# EAGLE design tubos (EAGLE 7.1.0)
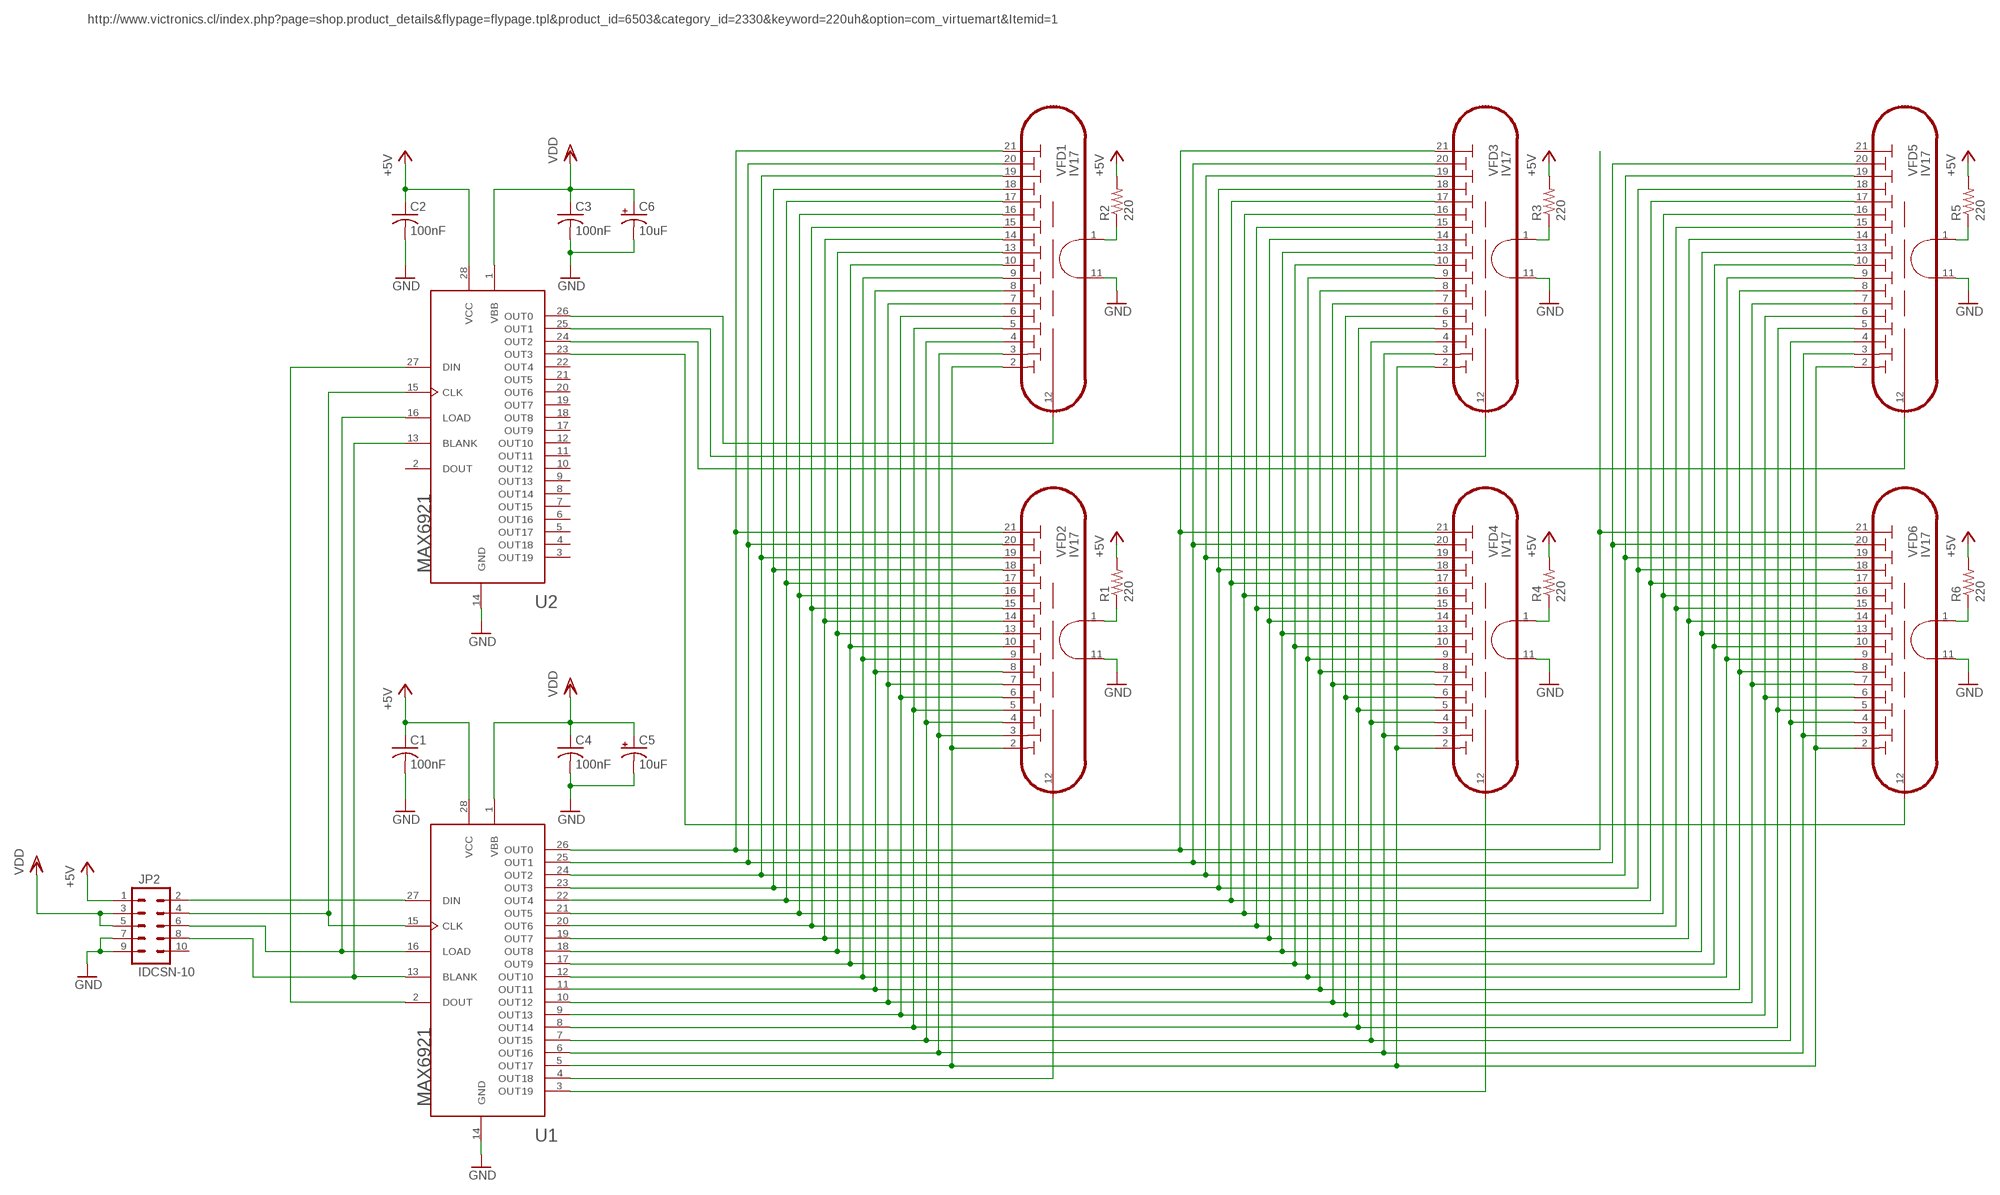
[diagram p0: schematic, sheet 1]

## Parts
C1  100nF  C-USC1206  [C1206]
C2  100nF  C-USC1206  [C1206]
C3  100nF  C-USC1210  [C1210]
C4  100nF  C-USC1210  [C1210]
C5  NACEW100M100V6.3X8TR  [NACEW100M100V6.3X8TR]
C6  NACEW100M100V6.3X8TR  [NACEW100M100V6.3X8TR]
JP2  IDCSN-10  [IDCSN-10]
R1  220  RESISTORPTH-1/4W  [AXIAL-0.4]
R2  220  RESISTORPTH-1/4W  [AXIAL-0.4]
R3  220  RESISTORPTH-1/4W  [AXIAL-0.4]
R4  220  RESISTORPTH-1/4W  [AXIAL-0.4]
R5  220  RESISTORPTH-1/4W  [AXIAL-0.4]
R6  220  RESISTORPTH-1/4W  [AXIAL-0.4]
U1  MAX6921AWI  [SO28W]
U2  MAX6921AWI  [SO28W]
VFD1  IV17  [CIRCULAR]
VFD2  IV17  [CIRCULAR]
VFD3  IV17  [CIRCULAR]
VFD4  IV17  [CIRCULAR]
VFD5  IV17  [CIRCULAR]
VFD6  IV17  [CIRCULAR]

## Nets
+5V [VCC]: C1.1 C2.1 JP2.1 R1.P$2 R2.P$2 R3.P$2 R4.P$2 R5.P$2 R6.P$2 U1.28(VCC) U2.28(VCC)
GND [GND]: C1.2 C2.2 C3.2 C4.2 C5.NEG(-) C6.NEG(-) JP2.7 JP2.9 U1.14(GND) U2.14(GND) VFD1.11 VFD2.11 VFD3.11 VFD4.11 VFD5.11 VFD6.11
N$1: U1.5(OUT17) VFD1.2 VFD2.2 VFD3.2 VFD4.2 VFD5.2 VFD6.2
N$2: R2.P$1 VFD1.1
N$3: U1.7(OUT15) VFD1.4 VFD2.4 VFD3.4 VFD4.4 VFD5.4 VFD6.4
N$4: R1.P$1 VFD2.1
N$5: U1.9(OUT13) VFD1.6 VFD2.6 VFD3.6 VFD4.6 VFD5.6 VFD6.6
N$6: R3.P$1 VFD3.1
N$7: U1.11(OUT11) VFD1.8 VFD2.8 VFD3.8 VFD4.8 VFD5.8 VFD6.8
N$8: U1.12(OUT10) VFD1.9 VFD2.9 VFD3.9 VFD4.9 VFD5.9 VFD6.9
N$9: R6.P$1 VFD6.1
N$10: U1.18(OUT8) VFD1.13 VFD2.13 VFD3.13 VFD4.13 VFD5.13 VFD6.13
N$11: R5.P$1 VFD5.1
N$12: U1.20(OUT6) VFD1.15 VFD2.15 VFD3.15 VFD4.15 VFD5.15 VFD6.15
N$13: U1.21(OUT5) VFD1.16 VFD2.16 VFD3.16 VFD4.16 VFD5.16 VFD6.16
N$14: U1.22(OUT4) VFD1.17 VFD2.17 VFD3.17 VFD4.17 VFD5.17 VFD6.17
N$15: R4.P$1 VFD4.1
N$16: U1.24(OUT2) VFD1.19 VFD2.19 VFD3.19 VFD4.19 VFD5.19 VFD6.19
N$17: U1.25(OUT1) VFD1.20 VFD2.20 VFD3.20 VFD4.20 VFD5.20 VFD6.20
N$18: U1.4(OUT18) VFD2.12
N$19: U1.3(OUT19) VFD4.12
N$20: U1.6(OUT16) VFD1.3 VFD2.3 VFD3.3 VFD4.3 VFD5.3 VFD6.3
N$21: U2.26(OUT0) VFD1.12
N$22: U1.8(OUT14) VFD1.5 VFD2.5 VFD3.5 VFD4.5 VFD5.5 VFD6.5
N$23: U2.25(OUT1) VFD3.12
N$24: U1.10(OUT12) VFD1.7 VFD2.7 VFD3.7 VFD4.7 VFD5.7 VFD6.7
N$25: U2.24(OUT2) VFD5.12
N$26: U2.23(OUT3) VFD6.12
N$27: U1.17(OUT9) VFD1.10 VFD2.10 VFD3.10 VFD4.10 VFD5.10 VFD6.10
N$28: U1.2(DOUT) U2.27(DIN)
N$29: U1.19(OUT7) VFD1.14 VFD2.14 VFD3.14 VFD4.14 VFD5.14 VFD6.14
N$30: JP2.4 U1.15(CLK) U2.15(CLK)
N$31: JP2.6 U1.16(LOAD) U2.16(LOAD)
N$32: JP2.8 U1.13(BLANK) U2.13(BLANK)
N$33: U1.23(OUT3) VFD1.18 VFD2.18 VFD3.18 VFD4.18 VFD5.18 VFD6.18
N$34: JP2.2 U1.27(DIN)
N$54: U1.26(OUT0) VFD1.21 VFD2.21 VFD3.21 VFD4.21 VFD6.21
VDD [VBB]: C3.1 C4.1 C5.POS(+) C6.POS(+) JP2.3 JP2.5 U1.1(VBB) U2.1(VBB)
Unconnected: JP2.10 U2.2(DOUT) U2.3(OUT19) U2.4(OUT18) U2.5(OUT17) U2.6(OUT16) U2.7(OUT15) U2.8(OUT14) U2.9(OUT13) U2.10(OUT12) U2.11(OUT11) U2.12(OUT10) U2.17(OUT9) U2.18(OUT8) U2.19(OUT7) U2.20(OUT6) U2.21(OUT5) U2.22(OUT4) VFD5.21

## Notes on the sheet
- http://www.victronics.cl/index.php?page=shop.product_details&flypage=flypage.tpl&product_id=6503&category_id=2330&keyword=220uh&option=com_virtuemart&Itemid=1

## Library data of the parts
C1-C4 = rcl:C-US: CAPACITOR, American symbol
C5 C6 = iv17:NACEW100M100V6.3X8TR: NACEW100M100V6.3X8TR 10uF 100v Surface Mount Aluminum Electrolytic Capacitor NACEW Series
JP2 = iv17:IDCSN-10: Conector idc 10p 90grad No parte: IDCSN-10 Fabricante: METALTEX
R1-R6 = SparkFun-Passives:RESISTOR: Resistor Basic schematic elements and footprints for 0603, 1206, and PTH resistors.
U1 U2 = iv17:MAX6921AWI: MAX6921AWI VFD Tube Drivers 20-Output, 76V, Serial-Interfaced
VFD1-VFD6 = iv17:IV17: IV-17 VFD 18seg display

## Net classes
1 GND: width 0.61 mm, clearance 0.203 mm
2 VCC: width 0.406 mm
3 VBB: width 0.406 mm, clearance 0.203 mm

## Board
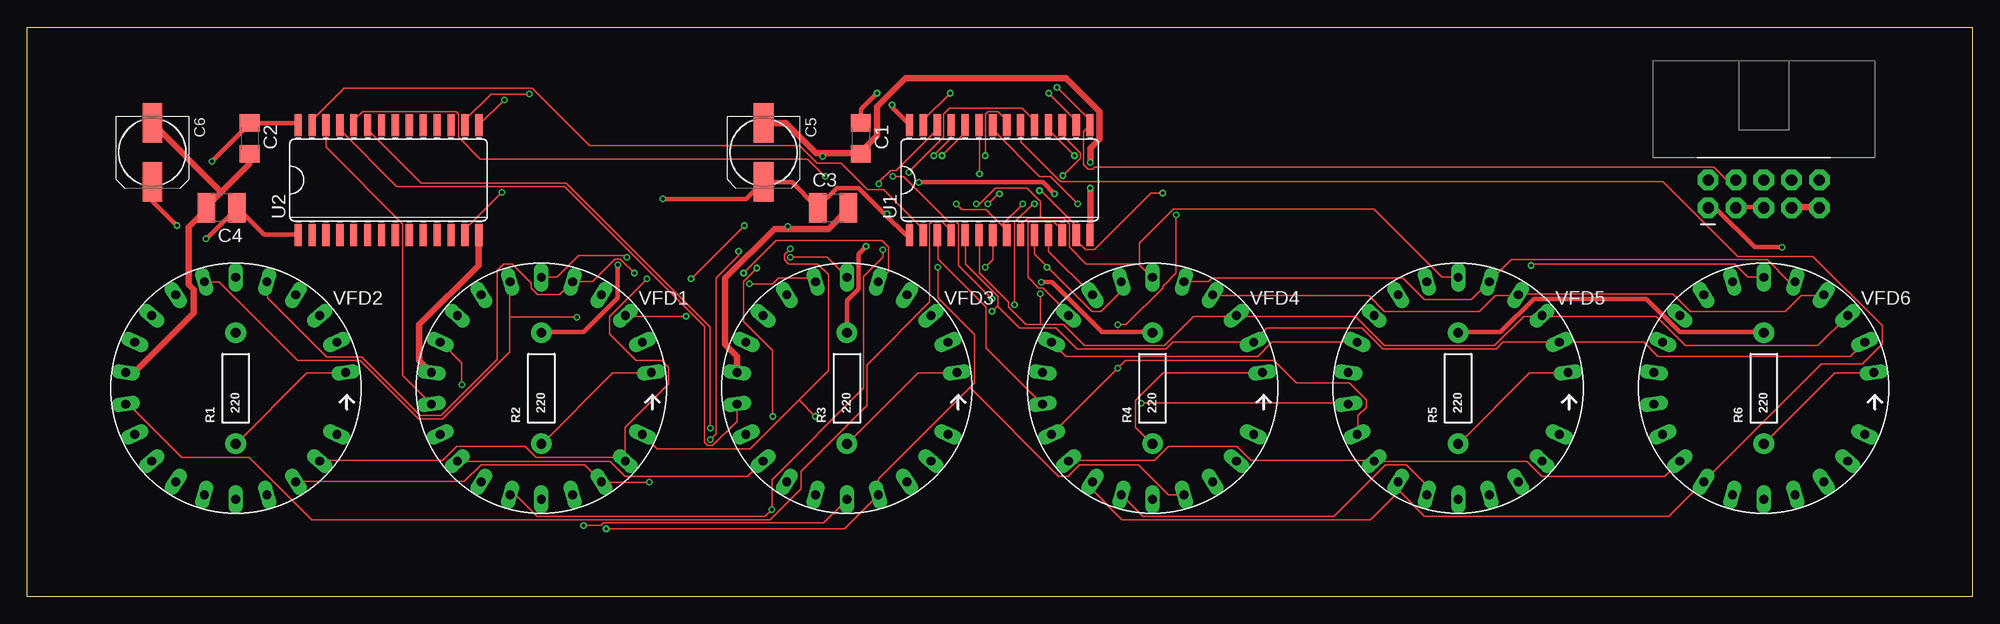
[diagram p1: board, top side]
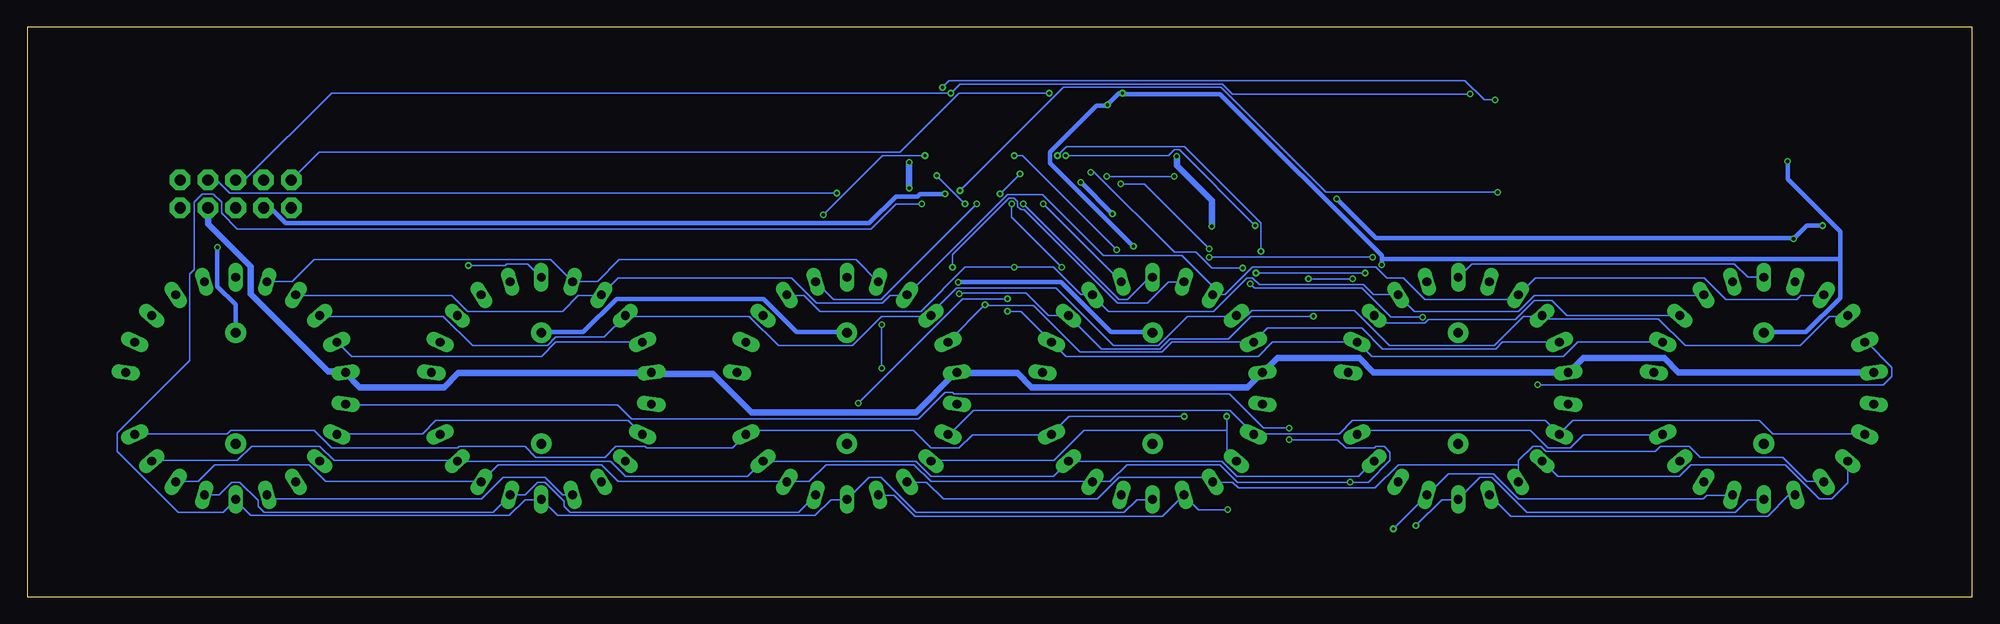
[diagram p2: board, bottom side, seen from below]

Size 177.8 x 52.07 mm. Coordinates in mm from the lower left corner, seen from the top.
Outline: 0,52.07 177.8,52.07 177.8,0 0,0 0,52.07
Copper layers (1*16): Top 0.035mm / dielectric 1.5mm / Bottom 0.035mm
Design rules "Fusion_eagle_rule_v1.1": minimum track width 6mil, minimum drill 12mil, track to track 6mil, track to pad 6mil, pad to pad 6mil, via to via 6mil, smd to smd 0mil, copper to edge 10mil, drill to drill 10mil, minimum pad ring 10mil, minimum via ring 6mil, stop-mask expansion 2mil, vias tented up to drill 100mil, thermal gap 10mil
tRestrict: 4 lines
bRestrict: 4 lines
vRestrict: area 151.1,33 to 166.4,40.6; area 16.5,21.6 to 21.6,26.7; area 16.5,11.4 to 21.6,16.5; area 44.4,21.6 to 49.5,26.7; area 44.4,11.4 to 49.5,16.5; area 72.4,21.6 to 77.5,26.7; area 72.4,11.4 to 77.5,16.5; area 100.3,21.6 to 105.4,26.7; area 100.3,11.4 to 105.4,16.5; area 128.3,21.6 to 133.3,26.7; area 128.3,11.4 to 133.3,16.5; area 156.2,21.6 to 161.3,26.7; 7 more areas; 32 lines

### Footprints (pad centres in the part's own frame; a part is rotated, then mirrored left to right if it is on the bottom)
C1206 = smd 1.6 x 1.8: 1 -1.4,0; 2 1.4,0
C1210 = smd 1.6 x 2.7: 1 -1.4,0; 2 1.4,0
NACEW100M100V6.3X8TR = smd 3.6 x 1.8: NEG -2.7,0; POS 2.7,0
IDCSN-10 = drill 1.016 pad 1.88 octagon: 1 -1.27,5.08; 2 1.27,5.08; 3 -1.27,2.54; 4 1.27,2.54; 5 -1.27,0; 6 1.27,0; 7 -1.27,-2.54; 8 1.27,-2.54; 9 -1.27,-5.08; 10 1.27,-5.08
AXIAL-0.4 = drill 0.9 pad 1.88: P$1 -5.08,0; P$2 5.08,0
SO28W = smd 0.66 x 2.032: 1 -8.255,-5.029; 2 -6.985,-5.029; 3 -5.715,-5.029; 4 -4.445,-5.029; 5 -3.175,-5.029; 6 -1.905,-5.029; 7 -0.635,-5.029; 8 0.635,-5.029; 9 1.905,-5.029; 10 3.175,-5.029; 11 4.445,-5.029; 12 5.715,-5.029; 13 6.985,-5.029; 14 8.255,-5.029; 15 8.255,5.029; 16 6.985,5.029; 17 5.715,5.029; 18 4.445,5.029; 19 3.175,5.029; 20 1.905,5.029; 21 0.635,5.029; 22 -0.635,5.029; 23 -1.905,5.029; 24 -3.175,5.029; 25 -4.445,5.029; 26 -5.715,5.029; 27 -6.985,5.029; 28 -8.255,5.029
CIRCULAR = drill 0.8 long: 1 10.057,1.446; 2 9.242,4.221; 3 7.678,6.653; 4 5.493,8.547; 5 2.862,9.748; 6 0,10.16; 7 -2.862,9.748; 8 -5.493,8.547; 9 -7.678,6.653; 10 -9.242,4.221; 11 -10.057,1.446; 12 -10.057,-1.446; 13 -9.242,-4.221; 14 -7.678,-6.653; 15 -5.493,-8.547; 16 -2.862,-9.748; 17 0,-10.16; 18 2.862,-9.748; 19 5.493,-8.547; 20 7.678,-6.653; 21 9.242,-4.221

### Placement (x,y rotation side)
C1  76.2,41.91 270 top
C2  20.32,41.91 270 top
C3  73.66,35.56 0 top
C4  17.78,35.56 180 top
C5  67.31,40.64 270 top
C6  11.43,40.64 270 top
JP2  158.75,36.83 90 top
R1  19.05,19.05 90 top
R2  46.99,19.05 90 top
R3  74.93,19.05 90 top
R4  102.87,19.05 90 top
R5  130.81,19.05 90 top
R6  158.75,19.05 90 top
U1  88.9,38.1 0 top
U2  33.02,38.1 0 top
VFD1  46.99,19.05 0 top
VFD2  19.05,19.05 0 top
VFD3  74.93,19.05 0 top
VFD4  102.87,19.05 0 top
VFD5  130.81,19.05 0 top
VFD6  158.75,19.05 0 top

### Tracks (layer width: path | path; a pad name or v marks a point on that pad's centre or on a via)
+5V  (via drill 0.3)
  Top 0.406: R6.P$2 158.75,24.18 151.05,24.18 148.01,27.23 137.72,27.23 134.67,24.18 130.86,24.18 R5.P$2 | v160.43,31.95 157.91,31.95 154.33,35.53 153.72,35.53 JP2.1 | U2.28 24.71,43.16 24.56,43.31 20.37,43.31 C2.1 20.22,43.16 v16.87,39.8 | v77.67,46.05 76.23,44.6 76.23,43.38 C1.1 | v79.05,44.98 79.05,44.76 80.65,43.16 U1.28 | v53.97,30.35 53.97,27.3 50.85,24.18 47.04,24.18 R2.P$2 | R3.P$2 74.93,27.08 76,28.14 76,31.34 v76.68,32.03 | v92.69,28.75 93.67,28.75 98.25,24.18 102.82,24.18 R4.P$2
  Bottom 0.406: R4.P$2 102.9,24.18 107.47,24.18 110.52,27.23 123.93,27.23 126.98,24.18 130.78,24.18 R5.P$2 | v160.43,31.95 160.43,28.37 158.75,26.7 R6.P$2 | v16.87,39.8 16.87,38.2 12.07,33.4 12.07,30.89 | 12.07,30.89 12.07,27.3 15.19,24.18 19,24.18 R1.P$2 | 53.97,30.89 53.97,31.19 68.76,45.97 77.52,45.97 v77.67,46.05 77.98,46.05 v79.05,44.98 79.2,44.91 80.04,44.91 84.3,40.64 84.3,39.65 v76.68,32.03 | 53.97,30.89 v53.97,30.35 | 53.97,30.89 12.07,30.89 | v92.69,28.75 83.31,28.75 78.74,24.18 74.93,24.18 R3.P$2
GND  (via drill 0.3)
  Top 0.61: JP2.7 161.34,35.61 163.78,35.61 JP2.9 | 72.72,40.56 72.11,40.56 69.37,43.31 67.31,43.31 C5.NEG | 72.72,40.56 76.15,40.56 C1.2 76.3,40.79 77.67,42.16 77.67,44.83 80.26,47.42 94.97,47.42 98.02,44.37 98.02,41.86 97.18,41.02 v97.18,39.73 | v97.18,37.36 97.18,33.1 U1.14 | 17.74,37.02 16.33,35.61 C4.2 16.26,35.31 14.73,33.78 14.73,28.52 15.19,28.07 15.19,25.93 9.78,20.52 9.02,20.52 VFD2.11 | 17.74,37.02 20.3,39.57 20.3,40.49 C2.2 | 17.74,37.02 11.46,43.31 C6.NEG | U2.14 41.25,33.02 41.25,30.28 35.84,24.87 35.84,21.59 36.91,20.52 VFD1.11 | 69.52,33.63 73.25,33.63 75.01,35.38 75.01,35.53 C3.2 | 69.52,33.63 68.3,33.63 63.8,29.13 63.8,23.04 64.87,21.97 64.87,20.52 VFD3.11 | v72.72,40.26 72.72,40.56 | v69.52,33.86 69.52,33.63
  Bottom 0.61: JP2.7 161.26,35.53 161.26,34.09 157.38,30.2 157.38,27.69 150.29,20.6 149,20.6 VFD6.11 148.69,20.45 147.4,19.15 139.7,19.15 138.41,20.45 120.8,20.45 VFD5.11 120.5,20.37 115.09,20.37 111.58,16.87 96.57,16.87 93.07,20.37 VFD4.11 92.76,20.45 87.27,20.45 85.98,19.15 66.24,19.15 64.95,20.45 VFD3.11 64.64,20.68 63.5,21.82 56.03,21.82 54.74,20.52 36.98,20.52 VFD1.11 36.68,20.68 35.53,21.82 28.14,21.82 26.85,20.52 9.02,20.52 VFD2.11 | v97.18,39.73 v97.18,37.36 | v72.72,40.26 72.72,39.42 69.52,36.22 v69.52,33.86
N$1  (via drill 0.3)
  Top 0.152: VFD6.2 167.97,23.27 166.67,21.97 149.07,21.97 147.78,23.27 140.08,23.27 VFD5.2 140,23.27 134.9,23.27 134.29,22.66 123.93,22.66 122.02,24.56 113.34,24.56 112.12,23.34 VFD4.2 112.04,23.27 104.72,23.27 104.12,22.66 95.96,22.66 94.06,24.56 90.7,24.56 88.68,26.58 | v88.19,26.09 88.68,26.58 | 88.68,26.58 88.72,26.62 88.72,27.46 85.75,30.43 85.75,33.02 U1.5
  Bottom 0.152: VFD2.2 36.07,23.27 37.36,21.97 54.89,21.97 56.18,23.27 VFD1.2 56.26,23.27 63.96,23.27 65.25,21.97 82.86,21.97 84.15,23.27 VFD3.2 84.23,23.34 86.97,26.09 v88.19,26.09
N$2
  Top 0.152: VFD1.1 57.02,20.45 53.52,20.45 47.04,13.97 R2.P$1
N$3  (via drill 0.3)
  Top 0.152: U1.7 88.27,30.81 v87.58,30.12 | VFD4.4 108.38,27.53 122.63,27.53 124.08,26.09 132.77,26.09 134.21,27.53 136.27,27.53 VFD5.4 136.35,27.61 136.42,27.69 150.44,27.69 152.04,26.09 160.73,26.09 162.18,27.53 164.24,27.53 VFD6.4
  Bottom 0.152: VFD2.4 24.56,27.53 40.03,27.53 41.48,26.09 51,26.09 52.45,27.53 VFD1.4 52.53,27.61 54.74,27.61 55.65,28.52 65.18,28.52 65.79,29.13 66.32,29.13 69.37,26.09 78.97,26.09 80.42,27.53 VFD3.4 80.49,27.61 81.48,27.61 84,30.12 v87.58,30.12 92.08,30.12 96.11,26.09 105.33,26.09 106.78,27.53 108.31,27.53 VFD4.4
N$4
  Top 0.152: VFD2.1 29.06,20.45 25.55,20.45 19.07,13.97 R1.P$1
N$5  (via drill 0.3)
  Top 0.152: 92.61,34.62 94.74,34.62 95.28,34.09 95.28,31.95 96.8,30.43 101.6,30.43 101.64,30.39 | 92.61,34.62 91.47,34.62 90.86,34.01 90.86,33.1 U1.9 | 101.64,30.39 102.82,29.21 VFD4.6 | v86.74,35.92 87.05,35.92 88.49,37.36 91.39,37.36 92.61,36.14 92.61,34.62 | VFD5.6 129.34,29.21 123.09,35.46 104.8,35.46 101.68,32.33 101.68,30.43 101.64,30.39 | VFD6.6 157.3,29.21 156.08,30.43 137.64,30.43 v137.49,30.28 | VFD1.6 48.41,29.21 50.39,31.19 54.66,31.19 v54.81,31.04 | v69.75,31.04 73.1,31.04 VFD3.6
  Bottom 0.152: VFD2.6 20.52,29.21 21.74,30.43 45.74,30.43 46.96,29.21 VFD1.6 | VFD3.6 75.16,29.21 77.22,27.15 77.98,27.15 v86.74,35.92 | v137.49,30.28 134.14,30.28 133.98,30.43 132.08,30.43 130.86,29.21 VFD5.6 | v69.75,31.04 v54.81,31.04
N$6
  Top 0.152: R3.P$1 81.41,20.45 84.91,20.45 VFD3.1
N$7
  Top 0.152: U1.11 93.37,33.02 93.37,31.57 97.33,27.61 VFD4.8
  Bottom 0.152: VFD2.8 13.59,27.53 15.65,27.53 16.03,27.15 22.5,27.15 24.49,29.13 39.95,29.13 41.48,27.61 VFD1.8 41.55,27.53 41.93,27.15 50.01,27.15 51.99,29.13 53.52,29.13 54.51,30.12 65.79,30.12 68.3,27.61 69.37,27.61 VFD3.8 69.37,27.69 69.37,28.3 72.26,31.19 79.43,31.19 84.99,36.75 88.19,36.75 97.33,27.61 VFD4.8 97.41,27.53 98.93,27.53 99.62,26.85 105.64,26.85 107.92,29.13 123.77,29.13 125.3,27.61 VFD5.8 125.37,27.53 127.43,27.53 128.88,26.09 137.57,26.09 139.01,27.53 153.19,27.53 VFD6.8
N$8
  Top 0.152: U1.12 94.59,33.1 94.59,33.55 93.83,34.31 91.62,34.31 91.47,34.16 91.47,29.21 92.46,28.22 92.84,28.22 95.12,25.93 95.12,25.7 VFD4.9
  Bottom 0.152: VFD2.9 11.38,25.63 13.06,25.63 15.72,22.96 26.24,22.96 28.68,25.4 39.04,25.4 39.27,25.63 VFD1.9 39.34,25.63 41.02,25.63 43.69,22.96 53.29,22.96 56.49,26.16 65.86,26.16 66.32,25.7 67.23,25.7 VFD3.9 67.31,25.63 71.73,25.63 74.4,22.96 78.51,22.96 83.77,28.22 92.84,28.22 95.12,25.93 95.12,25.7 VFD4.9 95.2,25.63 99.7,25.63 102.36,22.96 109.14,22.96 111.81,25.63 123.09,25.63 VFD5.9 123.17,25.63 125.07,23.72 129.49,23.72 130.25,22.96 137.11,22.96 139.78,25.63 151.05,25.63 VFD6.9
N$9
  Top 0.152: R6.P$1 165.23,20.45 168.73,20.45 VFD6.1
N$10  (via drill 0.3)
  Top 0.152: v95.73,40.34 93.37,42.7 93.37,43.08 U1.18 | v105.03,34.92 105.03,29.59 103.81,28.37 103.81,28.22 100.46,24.87 v99.7,24.87 | VFD4.13 93.67,14.88 v99.7,20.9 100.38,21.59 113.94,21.59 116,19.53 120.88,19.53 122.4,18.01 122.4,17.32 121.64,16.56 121.64,14.88 VFD5.13
  Bottom 0.152: VFD2.13 9.86,14.88 18.24,14.88 19.46,16.1 36.52,16.1 37.74,14.88 VFD1.13 37.82,14.88 39.04,16.1 56.64,16.1 57.86,14.88 65.63,14.88 VFD3.13 65.71,14.88 67.84,17.02 91.31,17.02 93.45,14.88 93.6,14.88 VFD4.13 | v95.73,40.34 99.62,40.34 v105.03,34.92 | v99.7,20.9 v99.7,24.87 | VFD6.13 149.45,14.88 141.68,14.88 140.46,16.1 122.86,16.1 121.64,14.88 VFD5.13
N$11
  Top 0.152: VFD5.1 140.84,20.45 137.34,20.45 130.86,13.97 R5.P$1
N$12
  Top 0.152: U1.20 90.86,43.08 90.86,41.55 94.44,37.97 149.53,37.97 156.39,31.12 163.25,31.12 169.57,24.79 169.57,23.11 167.74,21.29 164.01,21.29 153.26,10.54 VFD6.15 153.19,10.46 150.06,7.34 127.74,7.34 125.37,9.7 125.37,10.46 VFD5.15 125.37,9.63 122.78,7.04 100.08,7.04 97.41,9.7 97.41,10.46 VFD4.15
  Bottom 0.152: 41.48,12.06 41.48,10.54 VFD1.15 | 41.48,12.06 41.48,12.45 40.18,13.74 39.42,13.74 38.96,13.28 28.98,13.28 28.52,13.74 25.86,13.74 24.87,12.75 17.32,12.75 15.11,10.54 13.59,10.54 VFD2.15 | 41.48,12.06 52.45,12.06 54.58,9.93 67.08,9.93 67.62,10.46 69.37,10.46 VFD3.15 69.44,10.54 69.83,10.92 77.98,10.92 79.96,8.94 94.06,8.94 95.58,10.46 97.33,10.46 VFD4.15
N$13  (via drill 0.3)
  Top 0.152: v87.58,40.34 87.58,44.14 87.81,44.37 88.72,44.37 89.48,43.61 89.48,43.16 U1.21 | v78.21,31.73 78.21,31.04 76.45,29.29 76.45,19.07 68.07,10.69 v68.07,7.95 67.46,7.34 46.58,7.34 44.68,9.25 44.14,9.25 VFD1.16 | VFD5.16 127.89,9.32 127.89,10.24 126.06,12.06 124.16,12.06 119.43,7.34 101.98,7.34 100.08,9.25 VFD4.16
  Bottom 0.152: VFD2.16 16.26,9.25 16.79,9.25 18.69,7.34 42.16,7.34 44.07,9.25 VFD1.16 | VFD5.16 127.97,9.32 128.88,9.32 130.48,10.92 134.29,10.92 136.27,8.94 155.55,8.94 155.85,9.25 VFD6.16 | v87.58,40.34 86.82,40.34 v78.21,31.73 | v68.07,7.95 70.74,7.95 72.03,9.25 VFD3.16 72.11,9.25 74.02,7.34 96.65,7.34 98.55,9.25 100,9.25 VFD4.16
N$14  (via drill 0.3)
  Top 0.152: v50.85,6.5 52.45,6.5 52.68,6.73 72.8,6.73 74.93,8.86 VFD3.17 | U1.22 88.27,42.7 92.53,38.43 93.52,38.43 v96.04,35.92
  Bottom 0.152: VFD2.17 19.07,8.86 20.52,8.86 21.67,7.72 40.72,7.72 43.92,10.92 44.98,10.92 46.96,8.94 VFD1.17 47.04,8.86 48.49,8.86 v50.85,6.5 | VFD3.17 74.93,8.86 76.38,8.86 77.52,7.72 96.57,7.72 99.77,10.92 100.84,10.92 VFD4.17 102.9,8.86 104.34,8.86 105.79,7.42 129.34,7.42 VFD5.17 130.86,8.86 132.31,8.86 133.76,7.42 157.38,7.42 158.75,8.79 VFD6.17 158.75,8.86 159.89,7.72 164.01,7.72 169.57,13.28 169.57,14.96 162.94,21.59 162.94,29.52 162.56,29.9 162.56,36.07 161.8,36.83 160.81,36.83 160.04,36.07 160.04,35.08 158.6,33.63 100.69,33.63 98.4,35.92 v96.04,35.92
N$15
  Top 0.152: VFD4.1 112.88,20.45 103.81,20.45 101.3,17.93 101.3,15.49 102.82,13.97 R4.P$1
N$16  (via drill 0.3)
  Top 0.152: v83.62,40.34 85.67,42.39 85.67,43.08 U1.24 | v65.02,31.57 65.02,31.19 62.97,29.13 62.97,14.88 v62.43,14.35 | v56.87,10.46 52.53,10.46 VFD1.19 52.45,10.54 50.93,12.06 41.48,12.06 39.95,10.54 24.56,10.54 VFD2.19
  Bottom 0.152: VFD6.19 164.24,10.54 162.18,10.54 160.66,12.06 152.04,12.06 150.52,10.54 136.35,10.54 VFD5.19 136.27,10.54 134.75,12.06 125.3,12.06 123.77,10.54 108.38,10.54 VFD4.19 108.31,10.54 106.32,10.54 104.8,12.06 96.72,12.06 95.2,10.54 80.49,10.54 VFD3.19 80.42,10.54 78.82,10.54 77.29,12.06 68.76,12.06 67.16,10.46 v56.87,10.46 55.19,10.46 53.21,12.45 53.21,13.21 53.75,13.74 54.51,13.74 54.66,13.59 57.25,13.59 58.01,14.35 v62.43,14.35 | v83.62,40.34 82.78,41.17 72.03,41.17 65.02,34.16 v65.02,31.57
N$17  (via drill 0.3)
  Top 0.152: U1.25 84.45,41.94 v82.86,40.34 | v60.68,29.06 v65.56,33.93 | v56.64,29.06 53.21,25.63 53.21,24.03 55.65,21.59 58.01,21.59 58.62,20.98 58.62,19.46 54.66,15.49 54.66,12.75 | 54.66,12.75 54.66,12.45 VFD1.20 54.66,12.75 | 54.66,12.75 46.51,12.75 45.52,13.74 39.27,13.74 37.97,12.45 26.77,12.45 VFD2.20
  Bottom 0.152: VFD6.20 166.37,12.45 158.6,12.45 157.3,13.74 151.05,13.74 149.76,12.45 138.56,12.45 VFD5.20 138.48,12.37 124.46,12.37 123.09,11 111.96,11 110.59,12.37 VFD4.20 110.52,12.37 96.57,12.37 95.2,11 84,11 82.63,12.37 VFD3.20 82.55,12.37 68.61,12.37 67.23,11 56.11,11 54.74,12.37 VFD1.20 | v82.86,40.34 73.48,40.34 72.95,40.87 72.49,40.87 v65.56,33.93 | v56.64,29.06 v60.68,29.06
N$18
  Top 0.152: U1.4 84.45,33.48 83.62,34.31 82.7,34.31 82.47,34.09 82.47,26.92 76.76,21.21 76.76,17.47 70.74,11.45 70.74,9.86 67.92,7.04 26.01,7.04 20.3,12.75 14.12,12.75 9.32,17.55 9.02,17.55 VFD2.12
N$19
  Top 0.152: U1.3 83.24,33.02 83.24,30.89 87.66,26.47 87.66,22.73 92.76,17.63 VFD4.12
N$20  (via drill 0.3)
  Top 0.152: VFD6.3 166.37,25.63 163.7,22.96 151.59,22.96 148.92,25.63 138.56,25.63 VFD5.3 138.48,25.63 136.8,25.63 134.14,22.96 124.08,22.96 121.41,25.63 110.59,25.63 VFD4.3 110.52,25.63 106.63,25.63 103.96,22.96 96.65,22.96 94.74,24.87 92.61,24.87 | 92.61,24.87 91.31,24.87 89.71,26.47 89.71,26.92 87.05,29.59 87.05,33.02 U1.6 | 92.61,24.87 v92.61,27.69 | v60.22,25.63 54.74,25.63 VFD1.3
  Bottom 0.152: VFD2.3 26.77,25.7 37.06,25.7 38.43,27.08 40.03,27.08 41.78,25.32 49.71,25.32 50.01,25.02 54.05,25.02 54.66,25.63 VFD1.3 | v92.61,27.69 92.53,27.76 86.51,27.76 84.45,25.7 82.63,25.7 VFD3.3 82.55,25.63 79.58,22.66 74.24,22.66 73.33,23.57 68,23.57 65.94,25.63 v60.22,25.63
N$21
  Top 0.152: U2.26 27.3,41.1 34.31,34.09 34.31,20.22 36.91,17.63 VFD1.12
N$22  (via drill 0.3)
  Top 0.152: VFD2.5 21.97,28.75 21.97,27.3 27.38,21.89 30.58,21.89 35.92,16.56 37.82,16.56 42.93,21.67 42.93,29.82 43.54,30.43 44.3,30.43 46.05,28.68 46.05,28.22 46.66,27.61 48.64,27.61 49.78,28.75 VFD1.5 49.86,28.83 51.69,28.83 53.75,30.89 54.2,30.89 v55.5,29.59 | 89.06,33.97 87.66,35.38 85.45,35.38 v84.91,35.92 | 89.06,33.97 89.48,33.55 89.48,33.1 U1.8 | VFD4.5 105.79,28.83 108,28.83 108.31,29.13 125.76,29.13 127.74,27.15 132,27.15 133.6,28.75 VFD5.5 133.68,28.83 135.66,30.81 159.05,30.81 161.04,28.83 161.57,28.83 VFD6.5 | v91.01,35.92 89.06,33.97 | v65.48,29.59 68.45,32.56 78.13,32.56 78.74,31.95 78.74,29.74 77.83,28.83 VFD3.5
  Bottom 0.152: v84.91,35.92 77.83,28.83 VFD3.5 | v91.01,35.92 99.77,27.15 104.12,27.15 105.72,28.75 VFD4.5 | v65.48,29.59 v55.5,29.59
N$23
  Top 0.152: U2.25 28.6,43.08 28.6,42.7 33.78,37.52 49.1,37.52 61.9,24.71 61.9,14.12 62.2,13.82 62.66,13.82 64.87,16.03 64.87,17.55 VFD3.12
N$24  (via drill 0.3)
  Top 0.152: 44.07,25.55 44.07,28.75 VFD1.7 | 44.07,25.55 44.07,22.35 37.97,16.26 35.76,16.26 30.43,21.59 24.71,21.59 17.55,28.75 16.26,28.75 VFD2.7 | U1.10 92.08,31.34 93.26,30.16 | 93.26,30.16 97.33,26.09 98.17,26.09 100,27.91 100,28.75 VFD4.7 | v93.22,30.12 93.26,30.16 | v50.24,25.55 44.07,25.55 | v66.02,28.6 68.15,28.6 68.68,29.13 71.73,29.13 72.03,28.83 VFD3.7
  Bottom 0.152: v93.22,30.12 93.22,31.27 88.04,36.45 87.58,36.45 87.27,36.14 87.27,35.69 86.97,35.38 86.67,35.38 78.13,26.85 75.39,26.85 73.48,28.75 72.11,28.75 VFD3.7 | VFD4.7 100.08,28.83 102.06,30.81 123.7,30.81 125.68,28.83 127.89,28.83 VFD5.7 127.97,28.83 129.95,30.81 151.59,30.81 153.57,28.83 155.85,28.83 VFD6.7 | v50.24,25.55 53.14,25.55 55.8,28.22 65.63,28.22 v66.02,28.6
N$25  (via drill 0.3)
  Top 0.152: v72.95,38.43 71.35,40.03 41.4,40.03 39.42,42.01 39.42,44.14 39.19,44.37 30.66,44.37 29.9,43.61 29.9,43.16 U2.24 | v79.12,38.43 80.11,38.43 84.23,34.31 84.91,34.31 85.14,34.09 85.14,30.28 v88.19,27.23 | v101.83,17.7 120.65,17.7 120.73,17.63 VFD5.12
  Bottom 0.152: v79.12,38.43 v72.95,38.43 | v88.19,27.23 92.3,27.23 v101.83,17.7
N$26  (via drill 0.3)
  Top 0.152: U2.23 31.11,42.7 35.99,37.82 49.25,37.82 62.43,24.64 v62.43,15.42
  Bottom 0.152: v62.43,15.42 64.8,15.42 67.92,18.54 93.07,18.54 93.22,18.69 93.9,18.69 96.34,16.26 122.56,16.26 123.85,17.55 148.69,17.55 VFD6.12
N$27  (via drill 0.3)
  Top 0.152: v39.73,19.38 39.73,21.36 37.82,23.27 VFD1.10 | v94.67,38.51 96.27,40.11 96.27,40.56 94.67,42.16 94.67,43.08 U1.17 | v92.08,35.92 91.92,35.92 90.25,34.24 v90.25,26.7 | VFD5.10 113.79,23.27 112.5,21.97 94.97,21.97 93.67,23.27 VFD4.10
  Bottom 0.152: v39.73,19.38 8.1,19.38 7.34,20.14 7.34,20.98 9.63,23.27 9.78,23.27 VFD2.10 | VFD5.10 121.64,23.27 129.49,23.27 130.78,21.97 148.16,21.97 149.45,23.27 VFD6.10 | v92.08,35.92 v94.67,38.51 | VFD4.10 93.6,23.34 v90.25,26.7 90.25,26.62 85.83,26.62 81.56,22.35 74.09,22.35 73.18,23.27 65.71,23.27 VFD3.10 65.63,23.34 64.41,24.56 55.8,24.56 53.9,22.66 43.54,22.66 42.93,23.27 37.82,23.27 VFD1.10
N$28
  Top 0.152: U1.2 81.86,33.1 81.86,33.63 78.28,37.21 76.84,37.21 74.4,39.65 72.19,39.65 70.59,41.25 51.38,41.25 46.13,46.51 28.98,46.51 26.09,43.61 26.09,43.16 U2.27
N$29  (via drill 0.3)
  Top 0.152: VFD6.14 151.05,12.37 149.68,11 138.48,11 137.11,12.37 123.17,12.37 VFD5.14 123.09,12.45 111.89,12.45 110.59,13.74 104.34,13.74 103.05,12.45 95.2,12.45 VFD4.14 | U1.19 92.08,43.54 90.93,44.68 84.3,44.68 83.77,44.14 83.77,42.01 v80.57,38.81 | v66.7,30.05 65.48,28.83 65.48,25.17 68.15,22.5 v68.15,16.48 | VFD1.14 39.34,12.37 53.29,12.37 54.66,11 65.86,11 67.23,12.37 VFD3.14
  Bottom 0.152: VFD2.14 11.38,12.37 11.38,10.39 12.83,8.94 13.97,8.94 17.09,12.06 25.71,12.06 26.77,11 37.9,11 39.27,12.37 VFD1.14 | v80.57,38.81 80.26,38.81 72.95,31.5 70.97,31.5 69.52,30.05 v66.7,30.05 | 68.15,15.19 68.15,13.28 67.31,12.45 VFD3.14 | 68.15,15.19 v68.15,16.48 | 68.15,15.19 81.18,15.19 83.92,12.45 95.12,12.45 VFD4.14
N$30  (via drill 0.3)
  Top 0.152: v43.61,45.44 41.33,43.16 U2.15 | v94.13,46.58 97.1,43.61 97.1,43.16 U1.15 96.57,42.55 96.57,39.5 96.95,39.12 97.41,39.12 97.56,39.27 154.18,39.27 155.32,38.12 156.16,38.12 JP2.4
  Bottom 0.152: v43.61,45.44 44.6,45.44 46.35,47.19 93.52,47.19 v94.13,46.58
N$31  (via drill 0.3)
  Top 0.152: v45.9,45.97 42.39,45.97 40.03,43.61 40.03,43.16 U2.16 | v93.37,46.05 95.89,43.54 U1.16
  Bottom 0.152: v45.9,45.97 67.62,45.97 68.53,46.89 92.53,46.89 v93.37,46.05 149.99,46.05 157.91,38.12 158.75,38.12 JP2.6
N$32  (via drill 0.3)
  Top 0.152: v43.38,36.98 40.03,33.63 40.03,33.1 U2.13 | v92.53,37.13 92.69,37.13 95.89,33.93 U1.13 95.89,32.56 96.72,31.73 97.56,31.73 102.74,36.91 v103.81,36.91
  Bottom 0.152: v43.38,36.98 59.08,36.98 68.68,46.58 83.08,46.58 v92.53,37.13 | v103.81,36.91 159.28,36.91 160.43,38.05 161.26,38.05 JP2.8
N$33  (via drill 0.3)
  Top 0.152: v87.05,38.66 87.05,43.08 U1.23 | v88.88,36.83 88.72,36.83 v87.81,35.92 | v83.24,30.12 83.24,27.3 86.59,23.95 86.59,19.53 86.17,19.11 | 86.17,19.11 77.83,10.77 77.83,9.32 VFD3.18 77.75,9.25 74.7,6.2 v52.91,6.2 | 86.17,19.11 94.29,11 95.12,11 96.19,12.06 101.6,12.06 104.34,9.32 105.72,9.32 VFD4.18
  Bottom 0.152: VFD2.18 21.97,9.25 24.26,9.25 24.56,8.94 41.48,8.94 43.76,11.23 47.88,11.23 49.78,9.32 VFD1.18 49.86,9.25 v52.91,6.2 | v88.88,36.83 v87.05,38.66 | v87.81,35.92 87.81,34.7 v83.24,30.12 | VFD4.18 105.79,9.25 107.31,7.72 128.19,7.72 128.73,8.25 128.73,8.71 130.48,10.46 131.17,10.46 132.31,9.32 133.6,9.32 VFD5.18 133.68,9.25 135.2,7.72 156.16,7.72 156.69,8.25 156.69,8.79 158.37,10.46 159.13,10.46 160.27,9.32 161.57,9.32 VFD6.18
N$34  (via drill 0.3)
  Top 0.152: v84.38,46.05 81.94,43.61 81.94,43.16 U1.27
  Bottom 0.152: v84.38,46.05 92.61,46.05 98.02,40.64 151.13,40.64 JP2.2
N$54  (via drill 0.3)
  Top 0.152: v77.83,37.74 77.83,37.9 78.89,38.96 79.43,38.96 83.16,42.7 83.16,43.08 U1.26 | v69.75,31.8 69.22,31.27 69.22,30.81 69.6,30.43 72.26,30.43 73.25,29.44 73.25,20.68 70.55,17.97 | 70.55,17.97 66.09,13.51 57.56,13.51 56.26,14.81 VFD1.21 | v72.03,16.48 70.55,17.97
  Bottom 0.152: v77.83,37.74 75.69,37.74 v69.75,31.8 | VFD2.21 28.3,14.81 35.53,14.81 36.75,13.59 38.81,13.59 40.41,15.19 55.88,15.19 56.18,14.88 VFD1.21 | VFD6.21 167.97,14.88 159.51,14.88 159.21,15.19 151.59,15.19 149.99,13.59 138.48,13.59 138.33,13.74 132.31,13.74 131.32,12.75 124.99,12.75 124,13.74 121.34,13.74 121.18,13.59 113.34,13.59 112.12,14.81 VFD4.21 112.04,14.88 111.73,15.19 96.8,15.19 95.2,13.59 92.61,13.59 91.39,14.81 84.23,14.81 VFD3.21 84.15,14.88 82.55,16.48 v72.03,16.48
VDD  (via drill 0.3)
  Top 0.406: U2.1 24.71,33.1 21.67,33.1 19.23,35.53 C4.1 19.07,35.46 v16.33,32.71 | v13.67,33.93 11.46,36.14 11.46,37.9 C6.POS | JP2.3 156.23,35.61 158.75,35.61 JP2.5 | 78.47,34.89 76,37.36 74.02,37.36 72.26,35.61 C3.1 72.11,35.69 69.9,37.9 67.31,37.9 C5.POS 67.16,37.82 65.71,36.37 v58.09,36.37 | 78.47,34.89 80.26,33.1 80.65,33.1 U1.1 | v93.9,36.83 92.84,37.9 v81.48,37.9 | v78.59,35 78.47,34.89
  Bottom 0.406: v13.67,33.93 15.11,33.93 v16.33,32.71 16.48,32.79 54.51,32.79 v58.09,36.37 | v93.9,36.83 96.19,36.83 96.42,36.6 98.4,36.6 100.84,34.16 154.18,34.16 155.55,35.53 156.16,35.53 JP2.3 | v78.59,35 v81.48,37.9